# Altium schematic sheet [1]MCU.SchDoc
size B
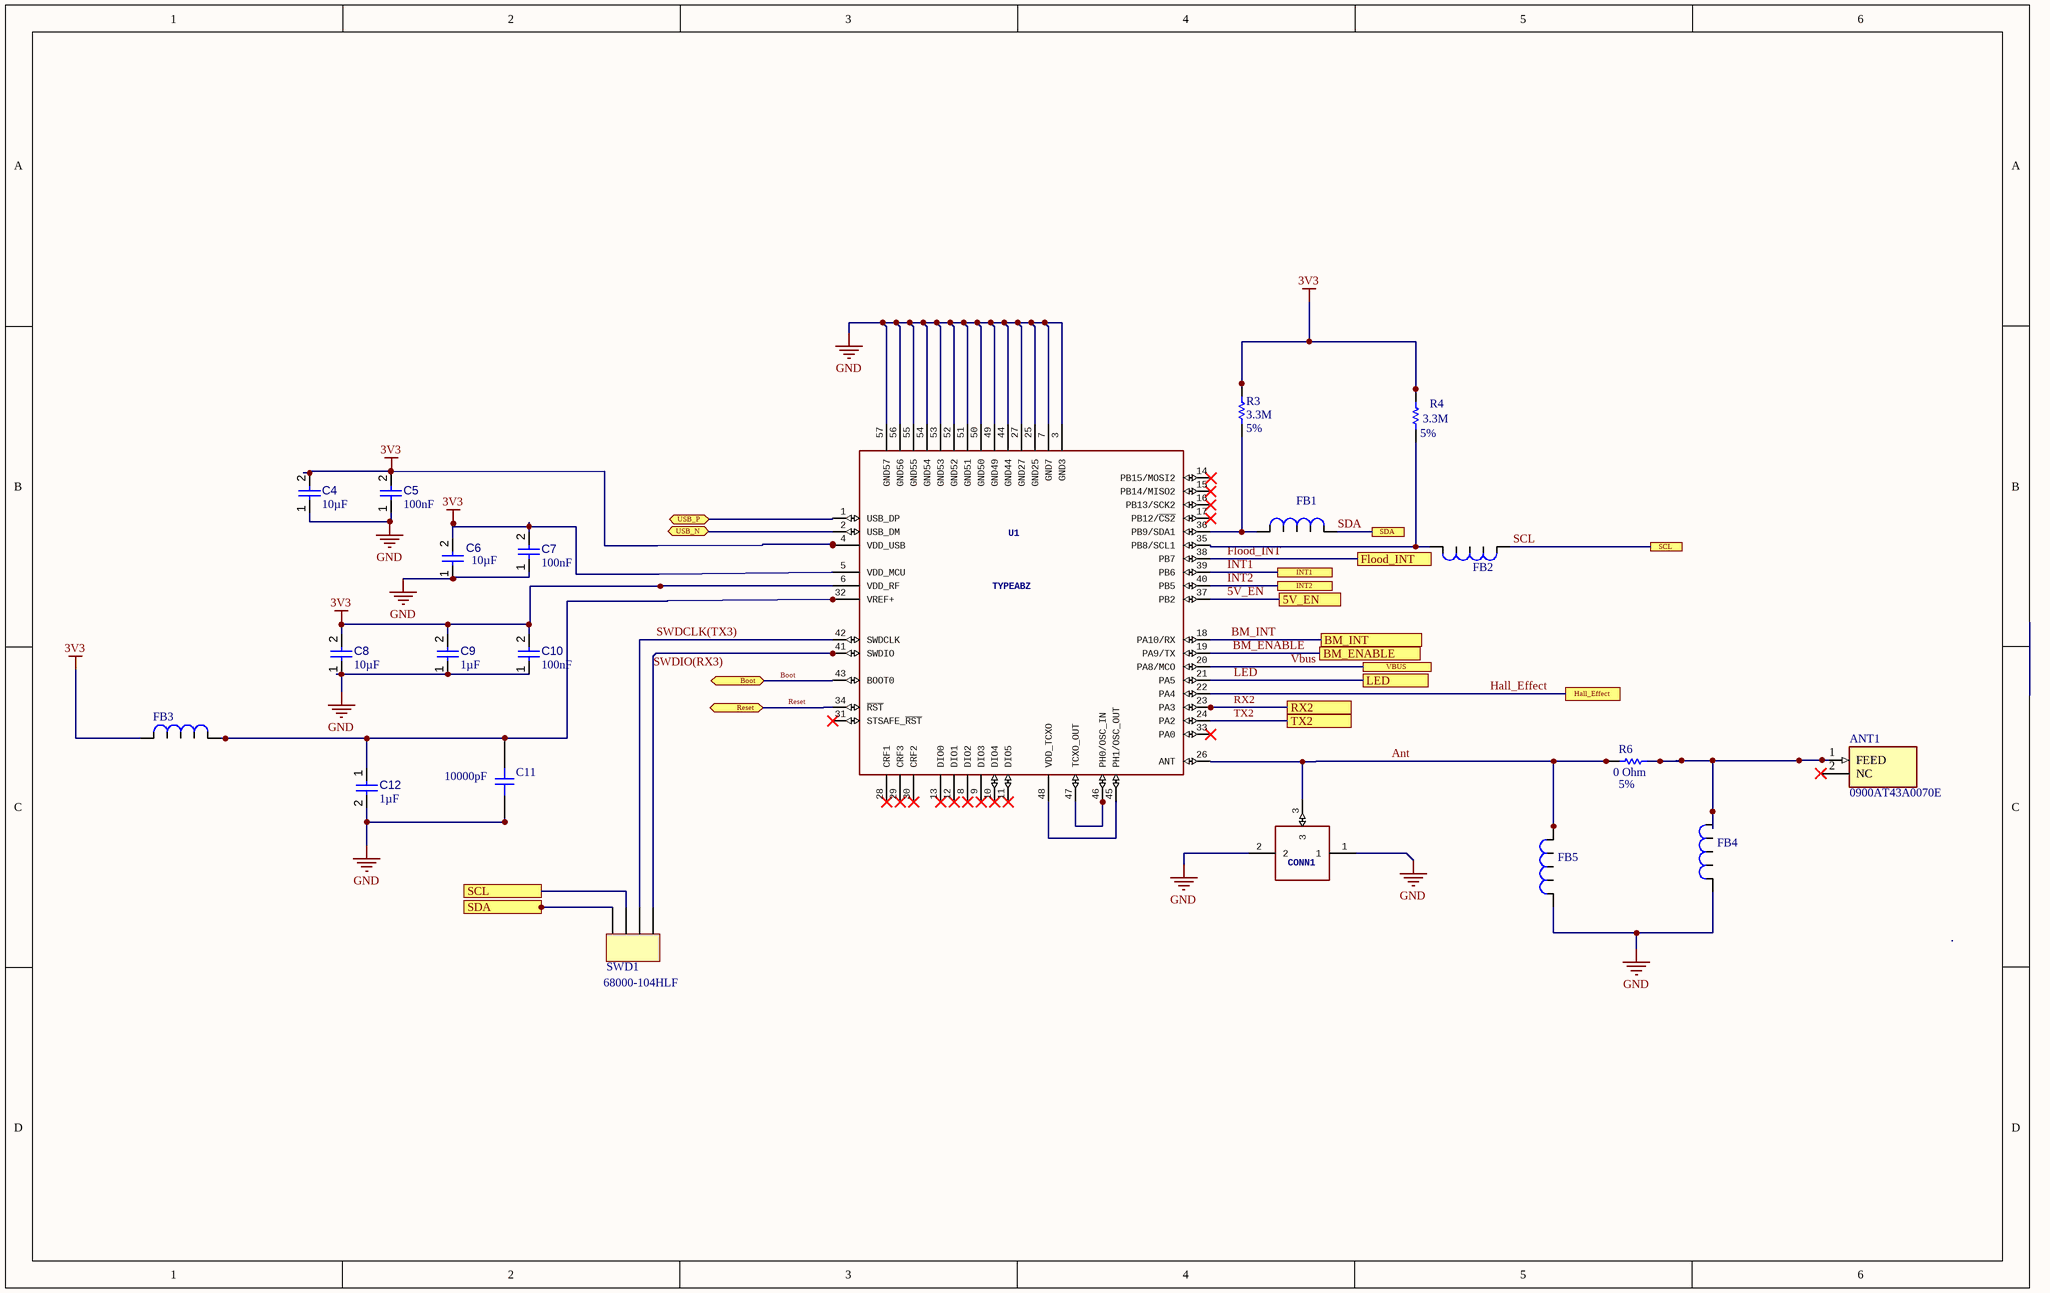
[diagram p0: [1]MCU.SchDoc]

## Parts
ANT1  0900AT43A0070E  [ANTC7020X90N]
C4  value 10µF  [CAPC0603(1608)100_L]  (hidden comment: Capacitor 10µF +/-20% 10V 0603)
C5  value 100nF  [CAPC1608X90X40ML10T20]  (hidden comment: Capacitor 100 nF +/-10% 50 V 0603)
C6  value 10µF  [CAPC0603(1608)100_L]  (hidden comment: Capacitor 10µF +/-20% 10V 0603)
C7  value 100nF  [CAPC1608X90X40ML10T20]  (hidden comment: Capacitor 100 nF +/-10% 50 V 0603)
C8  value 10µF  [CAPC0603(1608)100_L]  (hidden comment: Capacitor 10µF +/-20% 10V 0603)
C9  value 1µF  [CAPC1608X90X40ML10T20]  (hidden comment: Capacitor 1 uF +/- 10% 25 V 0603)
C10  value 100nF  [CAPC1608X90X40ML10T20]  (hidden comment: Capacitor 100 nF +/-10% 50 V 0603)
C11  10000PF  [CAPC0603]
C12  value 1µF  [CAPC1608X90X40ML10T20]  (hidden comment: Capacitor 1 uF +/- 10% 25 V 0603)
CONN1  U.FL-R-SMT-1  [U.FL-R-SMT-1]  (value not drawn)
FB1  BLM18AG102SN1D  [Ferrite Bead]  (value not drawn)
FB2  BLM18AG102SN1D  [Ferrite Bead]  (value not drawn)
FB3  BLM18AG102SN1D  [Ferrite Bead]  (value not drawn)
FB4  BLM18AG102SN1D  [Ferrite Bead]  (value not drawn)
FB5  BLM18AG102SN1D  [Ferrite Bead]  (value not drawn)
R3  value 3.3M  Tolerance: 5%  [RES 0603]  (hidden comment: RES 3.3M 5% 0.1W [0603])
R4  value 3.3M  Tolerance: 5%  [RES 0603]  (hidden comment: RES 3.3M 5% 0.1W [0603])
R6  value 0 Ohm  Tolerance: 5%  [RES 0603]  (hidden comment: RES 0 Ohm 5% 0.1W [0603])
SWD1  68000-104HLF  [4POS_HEADER]
U1  TYPEABZ  [CMWX1ZZABZ]

## Ports
5V_EN, BM_ENABLE, BM_INT, Boot (bidir), Flood_INT, Hall_Effect, INT1, INT2, LED, Reset (bidir), RX2, SCL, SDA, TX2, USB_N (bidir), USB_P (bidir), VBUS

## Nets
3V3: C4.2 C5.2 C6.2 C7.2 C8.2 C9.2 C10.2 FB3.2 R3.2 R4.2 U1.4(VDD_USB) U1.5(VDD_MCU) U1.6(VDD_RF)
GND: C4.1 C5.1 C6.1 C7.1 C8.1 C9.1 C10.1 C11.1 C12.2 CONN1.1 CONN1.2 FB4.2 FB5.2 U1.3(GND3) U1.7(GND7) U1.25(GND25) U1.27(GND27) U1.44(GND44) U1.49(GND49) U1.50(GND50) U1.51(GND51) U1.52(GND52) U1.53(GND53) U1.54(GND54) U1.55(GND55) U1.56(GND56) U1.57(GND57)
5V_EN: U1.37(PB2) ; port 5V_EN
Ant: CONN1.3 FB5.1 R6.1 U1.26(ANT)
BM_ENABLE: U1.19(PA9/TX) ; port BM_ENABLE
BM_INT: U1.18(PA10/RX) ; port BM_INT
Boot: U1.43(BOOT0) ; port Boot
Flood_INT: U1.38(PB7) ; port Flood_INT
Hall_Effect: U1.22(PA4) ; port Hall_Effect
INT1: U1.39(PB6) ; port INT1
INT2: U1.40(PB5) ; port INT2
LED: U1.21(PA5) ; port LED
Reset: U1.34(~{RST}) ; port Reset
RX2: U1.23(PA3) ; port RX2
SCL: FB2.2 SWD1.2 ; port SCL
SDA: FB1.2 SWD1.1 ; port SDA
SWDCLK(TX3): SWD1.3 U1.42(SWDCLK)
SWDIO(RX3): SWD1.4 U1.41(SWDIO)
TX2: U1.24(PA2) ; port TX2
USB_N: U1.2(USB_DM) ; port USB_N
USB_P: U1.1(USB_DP) ; port USB_P
Vbus: U1.20(PA8/MCO) ; port VBUS
NetANT1_1: ANT1.1(FEED) FB4.1 R6.2
NetC11_2: C11.2 C12.1 FB3.1 U1.32(VREF+)
NetFB1_1: FB1.1 R3.1 U1.36(PB9/SDA1)
NetFB2_1: FB2.1 R4.1 U1.35(PB8/SCL1)
NetU1_45: U1.45(PH1/OSC_OUT) U1.48(VDD_TCXO)
NetU1_46: U1.46(PH0/OSC_IN) U1.47(TCXO_OUT)

Not connected (* = marked no-connect by the designer): ANT1 2(NC); U1 8(DIO2)* 9(DIO3)* 10(DIO4)* 11(DIO5)* 12(DIO1)* 13(DIO0)* 14(PB15/MOSI2) 15(PB14/MISO2)* 16(PB13/SCK2)* 17(PB12/~{CS2})* 28(CRF1)* 29(CRF3)* 30(CRF2)* 31(STSAFE_~{RST})* 33(PA0)*

## Notes on the sheet
- Title
- Size:
- Date:
- A3
- Number:
- Time:
- Revision:
- Sheet
- of
- File:

## Library data of the parts
ANT1 = 0900AT43A0070E: Antenna; Manufacturer_Name: JOHANSON TECHNOLOGY; Datasheet Link: https://www.johansontechnology.com/datasheets/0900AT43A0070/0900AT43A0070.pdf; Height: 0.9mm; Manufacturer_Part_Number: 0900AT43A0070E
C4 C6 C8 = CMP-001-00075-2: Chip Capacitor, 10µF +/-20%, 10V, 0603, Thickness 1 mm; Tolerance: 10%; Mounting Technology: SMT; Pins: 2; Min Operating Temperature: -55°C; Case/Package: 0402; Max Operating Temperature: 85°C; Voltage Rating: 10V
C5 C7 C10 = CMP-001-00017-4: Chip Capacitor, 100 nF, +/- 10%, 50 V, 0603 (1608 Metric); Capacitor Type: Ceramic; Voltage Rating: 50V; RoHS Compliant: True; Max Operating Temperature: 125°C; Pins: 2; Mounting Technology: SM; Min Operating Temperature: -55°C; Tolerance: 10%; Case/Package: 0603
C9 C12 = CMP-001-00005-4: Chip Capacitor, 1 uF, +/- 10%, 25 V, 0603 (1608 Metric); Voltage Rating: 25V; Capacitor Type: Ceramic; Min Operating Temperature: -55°C; Tolerance: 10%; Max Operating Temperature: 125°C; Case/Package: 0603; RoHS Compliant: True; Mounting Technology: SM; Pins: 2
C11 = GRM188R71H103KA01D: CAP CER 10000PF 50V X7R 0603; Manufacturer: Murata Electronics North America; Tolerance: ±10%; Supplier 1: Digi-Key; Manufacturer Part Number: GRM188R71H103KA01D; RoHS: RoHS Compliant; Category: Capacitors; Stock 1: 5417714; Pricing 1: 1=0.14, 10=0.031, 100=0.0135, 500=0.00966, 1000=0.00758 (CAD); Packaging: Cut Tape (CT); Part Status: Active; Capacitance: 10000pF; Voltage - Rated: 50V; Temperature Coefficient: X7R; Operating Temperature: -55°C ~ 125°C; Features: -; Ratings: -; Applications: General Purpose; Mounting Type: Surface Mount, MLCC; Package / Case: 0603 (1608 Metric); Size / Dimension: 0.063" L x 0.031" W (1.60mm x 0.80mm); Height - Seated (Max): -; Thickness (Max): 0.035" (0.90mm); Lead Spacing: -; Lead Style: -; ComponentLink1URL: http://www.murata.com/~/media/webrenewal/support/library/catalog/products/capacitor/mlcc/c02e.ashx; ComponentLink1Description: http://www.murata.com/~/media/webrenewal/support/library/catalog/products/capacitor/mlcc/c02e.ashx; Supplier Part Number 1: 490-1512-1-ND
CONN1 = U.FL-R-SMT-1: GateName_1: G$1; SymbolName_1: U.FL-R-SMT-1; LibraryName: Kris; DeviceSetName: U.FL-R-SMT-1
FB1-FB5 = Ferrite Bead: Ferrite Bead 1KOhm @100MHz; Datasheet: https://www.murata.com/en-us/products/productdata/8796738650142/ENFA0003.pdf?src-supplier=Digi-Key; Supplier 1: Mouser; Supplier Part Number 1: 81-BLM11A102S; PN: BLM18AG102SN1D
R3 R4 = RES 3.3M 1% 0.1W [0603]: PN: CRCW06033M30FKEA; Supplier 1: Digi-Key; Supplier Part Number 1: 541-3.30MHCT-ND
R6 = RES 0 Ohm [0603]: PN: ERJ-3GEY0R00V; Supplier 1: Mouser; Supplier Part Number 1: 667-ERJ-3GEY0R00V; Datasheet: http://industrial.panasonic.com/cdbs/www-data/pdf/RDA0000/AOA0000C301.pdf?src-supplier=Farnell
SWD1 = 68000-104HLF: 4 Positions Header, Unshrouded Connector 0.100" (2.54mm) Through Hole Gold or Gold, GXT™; Manufacturer 1: Amphenol FCI; Number of Positions: 4; Gender: Male; Connector Type: Male Pin; Voltage Rating: 1.5kV; Current Rating: 3A; Insulation Resistance: 5GR; Mating Post Length: 5.84mm; Mount: Through Hole; Colour: Black; Housing Colour: Black; Housing Material: Thermoplastic; Contact Plating: Nickel,Gold,GXT; Contact Material: Bronze; Min Operating Temperature: -65°C; Max Operating Temperature: 125°C; Number of Rows: 1; Packaging: Bulk; Package Quantity: 100; Termination: Solder; Number of Contacts: 4; Orientation: Straight; Max Voltage Rating (AC): 1.5kV; Contact Gender: Male; Length: 10.16mm; Pitch: 2.54mm; Depth: 2.41mm; Termination Post Length: 2.41mm; Contact Mating Length: 0.23inch; Radiation Hardening: No; REACH SVHC: No SVHC; Flammability Rating: UL94 V-0; ComponentLink1URL: https://datasheet.ciiva.com/16726/68000-16726213.pdf; ComponentLink1Description: https://datasheet.ciiva.com/16726/68000-16726213.pdf; ComponentLink2URL: https://datasheet.ciiva.com/10149/68000-10149830.pdf; ComponentLink2Description: https://datasheet.ciiva.com/10149/68000-10149830.pdf; ComponentLink3URL: https://datasheet.ciiva.com/46395/1914865-46395854.pdf; ComponentLink3Description: https://datasheet.ciiva.com/46395/1914865-46395854.pdf; ComponentLink4URL: https://datasheet.ciiva.com/728/68000-728879.pdf; ComponentLink4Description: https://datasheet.ciiva.com/728/68000-728879.pdf; Description 1: 4 Positions Header, Unshrouded Connector 0.100" (2.54mm) Through Hole Gold or Gold, GXT™; Manufacturer Part Number 1: 68000-104HLF; Pricing 1: 1=0.33, 10=0.316, 100=0.2212, 500=0.18964, 1000=0.15803, 5000=0.13545, 10000=0.12642 (USD); Stock 1: 10785; Supplier 1: Digi-Key; Supplier Part Number 1: 609-3248-ND
U1 = TYPEABZ: CMWX1ZZABZ-078; GateName_1: G$1; SymbolName_1: TYPEABZ; DeviceSetName: TYPEABZ